# Altium project H204.PrjPCB
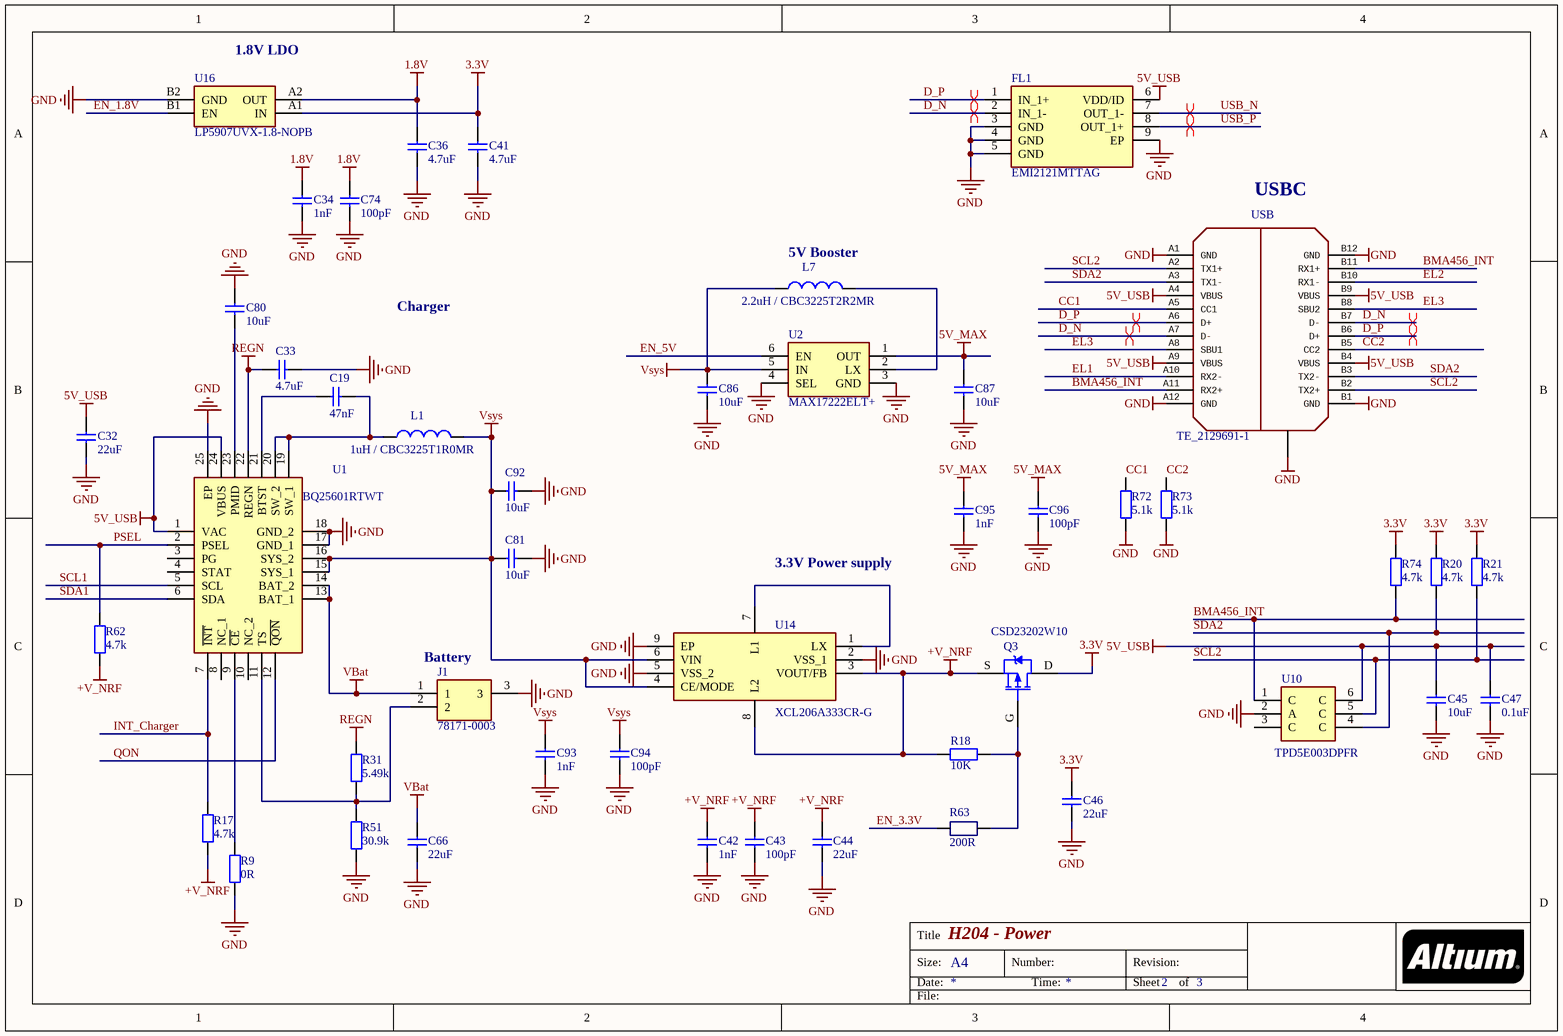
[diagram p0: H204_R_Power.SchDoc]
1 sheet, 46 parts. Net scope: global (net labels, ports and power ports of the same name join across sheets).
Board file: H204_.PcbDoc

## Sheet H204_R_Power.SchDoc: H204 - Power
size A4; SheetNumber: 2; SheetTotal: 3; PageSetup: Record=PageOptions|CenterHorizontal=True|CenterVertical=True|PrintScale=0.63|XCorrection=1.00|YCorrection=1.00|PrintKind=0|BorderSize=5000000|LeftOffset=0|BottomOffset=0|Orientation=2|PaperLength=2794|PaperWidth=4318|Scale=100|PaperSource=7|PrintQuality=600|MediaType=1|DitherType=10|PaperKind=Legal (8 ½ x 14 in)|PrintScaleMode=1

### Parts
C19  47nF  [CAPC0603X33N]
C32  22uF  [CAPC1005X55N]
C33  4.7uF  [CAPC1005X55N]
C34  1nF  [CAPC0603X33N]
C36  4.7uF  [CAPC1005X55N]
C41  4.7uF  [CAPC1005X55N]
C42  1nF  [CAPC0603X33N]
C43  100pF  [CAPC0603X33N]
C44  22uF  [CAPC1005X55N]
C45  10uF  [CAPC1005X55N]
C46  22uF  [CAPC1005X55N]
C47  0.1uF  [CAPC0603X33N]
C66  22uF  [CAPC1005X55N]
C74  100pF  [CAPC0603X33N]
C80  10uF  [CAPC1005X55N]
C81  10uF  [CAPC1005X55N]
C86  10uF  [CAPC1005X55N]
C87  10uF  [CAPC1005X55N]
C92  10uF  [CAPC1005X55N]
C93  1nF  [CAPC0603X33N]
C94  100pF  [CAPC0603X33N]
C95  1nF  [CAPC0603X33N]
C96  100pF  [CAPC0603X33N]
FL1  EMI2121MTTAG  [EMI2121MTTAG]
J1  78171-0003  [78171-0003]
L1  1uH / CBC3225T1R0MR  [INDM3225X210N]
L7  2.2uH / CBC3225T2R2MR  [INDM3225X210N]
Q3  CSD23202W10  [4-UFBGA]
R9  0R  [RESC0603X26N]
R17  4.7k  [RESC0603X26N]
R18  10k  [RESC0603X26N]
R20  4.7k  [RESC0603X26N]
R21  4.7k  [RESC0603X26N]
R31  5.49k  [RESC0603X26N]
R51  30.9k  [RESC0603X26N]
R62  4.7k  [RESC0603X26N]
R63  200R  [RESC0603X26N]
R72  5.1k  [RESC0603X26N]
R73  5.1k  [RESC0603X26N]
R74  4.7k  [RESC0603X26N]
U1  BQ25601RTWT  [QFN50P400X400X80-25N-D]
U2  MAX17222ELT+  [MAX17220ALT]
U10  TPD5E003DPFR  [SON35P100X100X40-6N]
U14  XCL206A333CR-G  [XCL206A333CRG]
U16  LP5907UVX-1.8-NOPB  [BGA4C35P2X2_64X64X44]
USB  TE_2129691-1  [TE_2129691-1]

### Nets
1.8V: C34.1 C36.1 C74.1 U16.A2(OUT)
3.3V: C41.1 C46.1 Q3.D R20.1 R21.1 R74.1 U16.A1(IN)
5V_MAX: C87.1 C95.1 C96.1 U2.1(OUT)
5V_USB: C32.1 C45.1 C47.1 FL1.6(VDD/ID) U1.1(VAC) U1.24(VBUS) U10.6(C) USB.A4(VBUS) USB.A9(VBUS) USB.B4(VBUS) USB.B9(VBUS)
+V_NRF: C42.2 C43.1 C44.1 Q3.S R17.2 R18.2 R62.2 U14.3(VOUT/FB) U14.8(L2)
GND: C32.2 C33.2 C34.2 C36.2 C41.2 C42.1 C43.2 C44.2 C45.2 C46.2 C47.2 C66.2 C74.2 C80.2 C81.2 C86.2 C87.2 C92.2 C93.2 C94.2 C95.2 C96.2 FL1.3(GND) FL1.4(GND) FL1.5(GND) FL1.9(EP) J1.3 R9.1 R51.2 R72.2 R73.2 U1.17(GND_1) U1.18(GND_2) U1.25(EP) U2.3(GND) U2.4(SEL) U10.2(A) U14.2(VSS_1) U14.5(VSS_2) U14.9(EP) U16.B2(GND) USB.A1(GND) USB.A12(GND) USB.B1(GND) USB.B12(GND) USB.SH
REGN: C33.1 R31.1 U1.22(REGN)
VBat: C66.1 J1.1 U1.13(BAT_1) U1.14(BAT_2)
Vsys: C81.1 C86.1 C92.1 C93.1 C94.1 L1.2 L7.1 U1.15(SYS_1) U1.16(SYS_2) U2.5(IN) U14.4(CE/MODE) U14.6(VIN)
BMA456_INT: R74.2 U10.1(C) USB.A11(RX2+) USB.B11(RX1+)
CC1: R72.1 USB.A5(CC1)
CC2: R73.1 USB.B5(CC2)
D_N: FL1.2(IN_1-) USB.A7(D-) USB.B7(D-)
D_P: FL1.1(IN_1+) USB.A6(D+) USB.B6(D+)
EL1: USB.A10(RX2-)
EL2: USB.B10(RX1-)
EL3: USB.A8(SBU1) USB.B8(SBU2)
EN_1.8V: U16.B1(EN)
EN_3.3V: R63.1
EN_5V: U2.6(EN)
INT_Charger: R17.1 U1.7(~{INT})
PSEL: R62.1 U1.2(PSEL)
QON: U1.12(~{QON})
SCL1: U1.5(SCL)
SCL2: R21.2 U10.5(C) USB.A2(TX1+) USB.B2(TX2+)
SDA1: U1.6(SDA)
SDA2: R20.2 U10.4(C) USB.A3(TX1-) USB.B3(TX2-)
USB_N: FL1.7(OUT_1-)
USB_P: FL1.8(OUT_1+)
NetC19_1: C19.1 L1.1 U1.19(SW_1) U1.20(SW_2)
NetC19_2: C19.2 U1.21(BTST)
NetC80_1: C80.1 U1.23(PMID)
NetJ1_2: J1.2 R31.2 R51.1 U1.11(TS)
NetL7_2: L7.2 U2.2(LX)
NetQ3_G: Q3.G R18.1 R63.2
NetR9_2: R9.2 U1.9(~{CE})
NetU14_1: U14.1(LX) U14.7(L1)

Not connected (* = marked no-connect by the designer): U1 3(PG) 4(STAT) 8(NC_1) 10(NC_2); U10 3(C)

### Layout directives
differential pair: D_N, D_P, USB_N, USB_P

### Notes on the sheet
- (near U16) 1.8V LDO
- USBC
- Charger
- (near L7) 5V Booster
- 3.3V Power supply
- (near J1) Battery
- Title
- Size:
- Date:
- A4
- Number:
- Time:
- Revision:
- Sheet
- of
- File:

### Library data of the parts
C19 = C0402-100n: CAP CER 0.047UF 25V X5R 0201; Manufacturer: TDK; Manufacturer Part Number: C0603X5R1E473K030BB; Dielectric Material: Ceramic; Tolerance: 10%; Supplier 1: Digi-Key; Supplier Part Number 1: 445-13679-1-ND; RoHS: Yes; Category: Ceramic Capacitors; Stock 1: 131887; Pricing 1: 1=0,10000, 10=0,07600, 50=0,04140, 100=0,03380, 500=0,02416, 1000=0,01898, 2500=0,01725, 5000=0,01587 (USD); Mount: Surface Mount; Case/Package: 0201; Case Code (Metric): 0603; Case Code (Imperial): 0201; Weight: 6E-06oz; Min Operating Temperature: -55°C; Max Operating Temperature: 85°C; Package Quantity: 15000; Packaging: Tape and Reel; Capacitance: 47nF; Voltage Rating: 25V; Dielectric: X5R; Termination: SMD/SMT; Voltage Rating (DC): 25V; Series: C; Length: 0.024inch; Width: 0.3mm; Height: 0.3mm; Thickness: 0.013inch; Lead Free: Lead Free; RoHS Compliant: Yes; ComponentLink1URL: https://datasheet.ciiva.com/14887/tdkmlcccaprange-14887813.pdf?src-supplier=Digi-Key; ComponentLink1Description: https://datasheet.ciiva.com/14887/tdkmlcccaprange-14887813.pdf?src-supplier=Digi-Key; ComponentLink2URL: https://datasheet.ciiva.com/14887/tdkmlcccaprange-14887815.pdf?src-supplier=Digi-Key; ComponentLink2Description: https://datasheet.ciiva.com/14887/tdkmlcccaprange-14887815.pdf?src-supplier=Digi-Key; ComponentLink3URL: https://datasheet.ciiva.com/14887/tdkmlcccaprange-14887817.pdf?src-supplier=Digi-Key; ComponentLink3Description: https://datasheet.ciiva.com/14887/tdkmlcccaprange-14887817.pdf?src-supplier=Digi-Key
C32 C44 C46 C66 = C0603-4µ7: CAP CER 22UF 6.3V X5R 0402; Manufacturer: Samsung; Manufacturer Part Number: CL05A226MQ5QUNC; Tolerance: 20%; Value: 22uF; Supplier 1: Digi-Key; Supplier Part Number 1: 1276-6834-1-ND; RoHS: Yes; Category: Ceramic Capacitors; Stock 1: 587155; Pricing 1: 1=0,60000, 10=0,42200, 50=0,31940, 100=0,27820, 500=0,20608, 1000=0,17517, 2500=0,16486, 5000=0,15456 (USD); Mount: Surface Mount; Case/Package: 0402; Case Code (Metric): 1005; Case Code (Imperial): 0402; Min Operating Temperature: -55°C; Max Operating Temperature: 85°C; Packaging: Tape and Reel; Capacitance: 22uF; Voltage Rating: 6.3V; Length: 0.039inch; Width: 0.02inch; Thickness: 0.022inch; RoHS Compliant: Yes; ComponentLink1URL: http://www.samsungsem.com/kr/support/product-search/mlcc/__icsFiles/afieldfile/2018/08/20/Data%20sheet_CL05A226MQ5QUNC.pdf?src-supplier=Digi-Key; ComponentLink1Description: http://www.samsungsem.com/kr/support/product-search/mlcc/__icsFiles/afieldfile/2018/08/20/Data%20sheet_CL05A226MQ5QUNC.pdf?src-supplier=Digi-Key
C33 C36 C41 = C0603-4µ7: Cap Ceramic 4.7uF 16V X5R 20% SMD 0402 85C T/R; Manufacturer: Samsung; Manufacturer Part Number: CL05A475MO5NUNC; Value: 4.7uF; Supplier 1: Digi-Key; Supplier Part Number 1: 1276-6836-1-ND; RoHS: Yes; Category: Ceramic Capacitors; Stock 1: 298882; Pricing 1: 1=0,51000, 10=0,35100, 50=0,24600, 100=0,21090, 500=0,15814, 1000=0,13355, 2500=0,12652, 5000=0,11949 (USD); Mount: Surface Mount; Case/Package: 0402; Case Code (Metric): 1005; Case Code (Imperial): 0402; Min Operating Temperature: -55°C; Max Operating Temperature: 85°C; Packaging: Tape and Reel; Capacitance: 4.7uF; Voltage Rating: 16V; Tolerance: 20%; Length: 0.039inch; Width: 0.02inch; Thickness: 0.022inch; RoHS Compliant: Yes; ComponentLink1URL: http://www.farnell.com/datasheets/2710653.pdf?src-supplier=Farnell; ComponentLink1Description: http://www.farnell.com/datasheets/2710653.pdf?src-supplier=Farnell; ComponentLink2URL: http://www.farnell.com/datasheets/2710653.pdf?src-supplier=Newark; ComponentLink2Description: http://www.farnell.com/datasheets/2710653.pdf?src-supplier=Newark; ComponentLink3URL: http://www.samsungsem.com/kr/support/product-search/mlcc/CL05A475MO5NUNC.jsp?src-supplier=Digi-Key; ComponentLink3Description: http://www.samsungsem.com/kr/support/product-search/mlcc/CL05A475MO5NUNC.jsp?src-supplier=Digi-Key
C34 C42 C93 C95 = C0402-100n: Cap Ceramic 0.001uF 25V X7R 10% SMD 0201 125C Paper T/R; Manufacturer: Samsung; Manufacturer Part Number: CL03B102KA3NNNC; Value: 1nF; Supplier 1: Digi-Key; Supplier Part Number 1: 1276-1341-1-ND; RoHS: Yes; Category: Ceramic Capacitors; Stock 1: 1034478; Pricing 1: 1=0,13000, 10=0,08900, 50=0,05080, 100=0,04200, 500=0,02946, 1000=0,02439, 2500=0,02270, 5000=0,02077 (USD); Mount: Surface Mount; Case/Package: 0201; Contact Plating: Tin; Case Code (Metric): 0603; Case Code (Imperial): 0201; Min Operating Temperature: -55°C; Max Operating Temperature: 125°C; Package Quantity: 1; Packaging: Tape and Reel; Capacitance: 1nF; Tolerance: 10%; Dielectric: X7R; Voltage Rating: 25V; Series: CL; Construction: Flat; Length: 0.6mm; Width: 0.012inch; Height: 0.3mm; Thickness: 0.013inch; Depth: 0.3mm; Radiation Hardening: No; RoHS Compliant: Yes; ComponentLink1URL: https://datasheet.ciiva.com/25788/cl03b102ka3nnnc-25788656.pdf?src-supplier=Digi-Key; ComponentLink1Description: https://datasheet.ciiva.com/25788/cl03b102ka3nnnc-25788656.pdf?src-supplier=Digi-Key; ComponentLink2URL: https://datasheet.ciiva.com/26838/getdatasheetpartid-355161-26838110.pdf?src-supplier=Verical; ComponentLink2Description: https://datasheet.ciiva.com/26838/getdatasheetpartid-355161-26838110.pdf?src-supplier=Verical
C43 C74 C94 C96 = C0402-100n: CAP CER 100PF 50V C0G 0201; Manufacturer: TDK; Manufacturer Part Number: C0603C0G1H101J030BA; Dielectric Material: Ceramic; Tolerance: 5%; Insulation Resistance: 10GR; Value: 100pF; Supplier 1: Digi-Key; Supplier Part Number 1: 445-1786-1-ND; RoHS: Yes; Category: Ceramic Capacitors; Stock 1: 312493; Pricing 1: 1=0,10000, 10=0,06800, 50=0,03720, 100=0,03040, 500=0,02174, 1000=0,01708, 2500=0,01552, 5000=0,01428 (USD); Mount: Surface Mount; Case/Package: 0201; Number of Pins: 2; Case Code (Metric): 0603; Case Code (Imperial): 0201; Weight: 6E-06oz; Min Operating Temperature: -55°C; Max Operating Temperature: 125°C; Package Quantity: 1; Capacitance: 100pF; Voltage Rating: 50V; Packaging: Tape and Reel; Voltage Rating (DC): 50V; Dielectric: C0G; Termination: SMD/SMT; Construction: Flat; Voltage: 50V; Series: C; Length: 0.6mm; Width: 0.012inch; Height: 0.3mm; Depth: 0.3mm; Thickness: 0.013inch; Lead Free: Lead Free; REACH SVHC: Unknown; RoHS Compliant: Yes; ComponentLink1URL: https://datasheet.ciiva.com/24217/c0603c0g1h101j030ba-264106-24217425.pdf?src-supplier=Mouser; ComponentLink1Description: https://datasheet.ciiva.com/24217/c0603c0g1h101j030ba-264106-24217425.pdf?src-supplier=Mouser; ComponentLink2URL: https://datasheet.ciiva.com/16205/mlcc-commercial-general-en-16205590.pdf?src-supplier=Future+Electronics; ComponentLink2Description: https://datasheet.ciiva.com/16205/mlcc-commercial-general-en-16205590.pdf?src-supplier=Future+Electronics; ComponentLink3URL: https://datasheet.ciiva.com/6250/tdkmlcccaprange-6250351.pdf?src-supplier=Digi-Key; ComponentLink3Description: https://datasheet.ciiva.com/6250/tdkmlcccaprange-6250351.pdf?src-supplier=Digi-Key
C45 C80 C81 C86 C87 C92 = C0603-4µ7: CAP CER 10UF 10V X5R 0402; Manufacturer: Samsung; Manufacturer Part Number: CL05A106MP8NUB8; Tolerance: 20%; Value: 10uF; Supplier 1: Digi-Key; Supplier Part Number 1: 1276-6830-2-ND; RoHS: Yes; Category: Ceramic Capacitors; Stock 1: 5635891; Pricing 1: 8000=0,08247 (USD); Mount: Surface Mount; Case/Package: 0402; Case Code (Metric): 1005; Case Code (Imperial): 0402; Min Operating Temperature: -55°C; Max Operating Temperature: 85°C; Packaging: Tape and Reel; Capacitance: 10uF; Voltage Rating: 10V; Length: 0.039inch; Width: 0.02inch; Thickness: 0.035inch; RoHS Compliant: Yes; ComponentLink1URL: http://www.samsungsem.com/kr/support/product-search/mlcc/CL05A106MP8NUB8.jsp?src-supplier=Digi-Key; ComponentLink1Description: http://www.samsungsem.com/kr/support/product-search/mlcc/CL05A106MP8NUB8.jsp?src-supplier=Digi-Key
C47 = C0201-100n: CAP CER 0.1UF 16V X5R 0201; Manufacturer: Samsung; Manufacturer Part Number: CL03A104KO3NNNC; Capacitance: 100nF; Tolerance: 10%; Value: 0.1uF; Supplier 1: Digi-Key; Supplier Part Number 1: 1276-1319-1-ND; RoHS: Yes; Category: Ceramic Capacitors; Stock 1: 1005663; Pricing 1: 1=0,12000, 10=0,08500, 50=0,04640, 100=0,03790, 500=0,02704, 1000=0,02125, 2500=0,01932, 5000=0,01777 (USD); Mount: Surface Mount; Case/Package: 0201; Case Code (Metric): 0603; Case Code (Imperial): 0201; Contact Plating: Tin; Min Operating Temperature: -55°C; Max Operating Temperature: 85°C; Package Quantity: 1; Packaging: Tape and Reel; Voltage Rating: 16V; Dielectric: X5R; Voltage Rating (DC): 16V; Series: CL; Construction: Flat; Length: 0.6mm; Width: 0.012inch; Height: 0.3mm; Thickness: 0.013inch; Depth: 0.3mm; Radiation Hardening: No; RoHS Compliant: Yes; ComponentLink1URL: https://datasheet.ciiva.com/25794/cl03a104ko3nnnc-25794320.pdf?src-supplier=Digi-Key; ComponentLink1Description: https://datasheet.ciiva.com/25794/cl03a104ko3nnnc-25794320.pdf?src-supplier=Digi-Key; ComponentLink2URL: https://datasheet.ciiva.com/26838/getdatasheetpartid-359638-26838082.pdf?src-supplier=Verical; ComponentLink2Description: https://datasheet.ciiva.com/26838/getdatasheetpartid-359638-26838082.pdf?src-supplier=Verical
FL1 = EMI2121MTTAG: ON SEMICONDUCTOR - EMI2121MTTAG - Common Mode Filter, USB 2.0, WDFN-8; Number of Lines: 3; DC Resistance (DCR): 8R; Max Current Rating: 100mA; Capacitance: 1.3pF; Voltage Rating: 9V; Direction: Bidirectional; ESD Protection: Yes; Assembly: Rechargeable; Supplier 1: Digi-Key; Supplier Part Number 1: EMI2121MTTAGOSCT-ND; Manufacturer: ON Semiconductor; Manufacturer Part Number: EMI2121MTTAG; RoHS: Yes; Category: Common Mode Chokes; Stock 1: 14076; Pricing 1: 1=1,01000, 10=0,89900, 25=0,85320, 100=0,70090, 250=0,65520, 500=0,57902, 1000=0,50312 (USD); Number of Pins: 8; Min Operating Temperature: -40°C; Max Operating Temperature: 85°C; Packaging: Tape and Reel; Package Quantity: 1; Current: 100mA; Termination: Flat; Current Rating: 100mA; Max DC Current: 100mA; Series: -; DC Resistance-Max: 8R; Length: 2.2mm; Width: 0.079inch; Height: 0.031inch; Depth: 2mm; Lead Free: Lead Free; Halogen Free: Halogen Free; RoHS Compliant: Yes; REACH SVHC: No SVHC; ComponentLink1URL: https://datasheet.ciiva.com/6214/emi2121mt-d-6214625.pdf?src-supplier=Digi-Key; ComponentLink1Description: https://datasheet.ciiva.com/6214/emi2121mt-d-6214625.pdf?src-supplier=Digi-Key; ComponentLink2URL: https://datasheet.ciiva.com/12394/emi2121mt-d-72518-12394918.pdf?src-supplier=Mouser; ComponentLink2Description: https://datasheet.ciiva.com/12394/emi2121mt-d-72518-12394918.pdf?src-supplier=Mouser; ComponentLink3URL: https://datasheet.ciiva.com/3067/emi2121mt-d-3067884.pdf?src-supplier=Avnet; ComponentLink3Description: https://datasheet.ciiva.com/3067/emi2121mt-d-3067884.pdf?src-supplier=Avnet; ComponentLink4URL: https://datasheet.ciiva.com/6214/emi2121mt-d-6214619.pdf?src-supplier=Digi-Key; ComponentLink4Description: https://datasheet.ciiva.com/6214/emi2121mt-d-6214619.pdf?src-supplier=Digi-Key; ComponentLink5URL: https://datasheet.ciiva.com/15162/getdatasheetpartid-686641-15162525.pdf?src-supplier=Verical; ComponentLink5Description: https://datasheet.ciiva.com/15162/getdatasheetpartid-686641-15162525.pdf?src-supplier=Verical; ComponentLink6URL: https://datasheet.ciiva.com/16437/emi2121mt-d-16437709.pdf?src-supplier=Future+Electronics; ComponentLink6Description: https://datasheet.ciiva.com/16437/emi2121mt-d-16437709.pdf?src-supplier=Future+Electronics; ComponentLink7URL: https://datasheet.ciiva.com/6214/emi2121mt-d-6214622.pdf?src-supplier=Digi-Key; ComponentLink7Description: https://datasheet.ciiva.com/6214/emi2121mt-d-6214622.pdf?src-supplier=Digi-Key
J1 = 78171-0003: Conn Wire to Board HDR 3 POS 1.2mm Solder ST SMD Embossed T/R; Manufacturer_Name: Molex; Number of Contacts: 3; Contact Resistance: 20mR; Max Voltage Rating (DC): 5.05kV; Max Voltage Rating (AC): 50V; Current Rating: 1.5A; Gender: Male; Glow Wire Compliant: Non-compliant; Datasheet Link: http://docs-emea.rs-online.com/webdocs/150e/0900766b8150e2fd.pdf; Manufacturer_Part_Number: 78171-0003; Mouser Part Number: 538-78171-0003; Mouser Price/Stock: https://www.mouser.co.uk/ProductDetail/Molex/78171-0003?qs=rg3U%2F5nEhHfwDfjly946YA%3D%3D; Supplier 1: Digi-Key; Supplier Part Number 1: WM5409CT-ND; Manufacturer: Molex; Manufacturer Part Number: 78171-0003; RoHS: Yes; Category: Headers and Wire Housings; Pricing 1: 1=0,40000, 10=0,32100, 100=0,23540, 1000=0,18724 (USD); Mount: Surface Mount; Contact Plating: Gold; Contact Material: Copper Alloy,Copper; Housing Color: Black; Housing Material: Polymer; Min Operating Temperature: -25°C; Max Operating Temperature: 85°C; Number of Rows: 1; Termination: Solder; Packaging: Tape and Reel; Number of Positions: 3; Orientation: Vertical; Series: Pico-Ezmate; Voltage Rating: 50V; Contact Gender: Male; Package Quantity: 4500; Voltage Rating (AC): 50V; Number of Circuits: 3; Length: 5.4mm; Pitch: 1.2mm; Depth: 4.5mm; Radiation Hardening: No; RoHS Compliant: Yes; REACH SVHC: Unknown; Halogen Free: Low Halogen; ComponentLink1URL: https://datasheet.ciiva.com/22680/1701259-22680435.pdf?src-supplier=Element14; ComponentLink1Description: https://datasheet.ciiva.com/22680/1701259-22680435.pdf?src-supplier=Element14; ComponentLink2URL: https://datasheet.ciiva.com/5152/0781710003-pcb-headers-152538-5152745.pdf?src-supplier=Mouser; ComponentLink2Description: https://datasheet.ciiva.com/5152/0781710003-pcb-headers-152538-5152745.pdf?src-supplier=Mouser; ComponentLink3URL: https://datasheet.ciiva.com/11746/0900766b80dca492-11746471.pdf?src-supplier=RSComponents; ComponentLink3Description: https://datasheet.ciiva.com/11746/0900766b80dca492-11746471.pdf?src-supplier=RSComponents; ComponentLink4URL: https://datasheet.ciiva.com/16108/16720781710003-pcb-headers-16108033.pdf?src-supplier=Onlinecomponents.com; ComponentLink4Description: https://datasheet.ciiva.com/16108/16720781710003-pcb-headers-16108033.pdf?src-supplier=Onlinecomponents.com; ComponentLink5URL: https://datasheet.ciiva.com/30073/92470781710003-pcb-headers-30073464.pdf?src-supplier=Onlinecomponents.com; ComponentLink5Description: https://datasheet.ciiva.com/30073/92470781710003-pcb-headers-30073464.pdf?src-supplier=Onlinecomponents.com; ComponentLink6URL: https://datasheet.ciiva.com/10088/0781710003-pcb-headers-10088254.pdf?src-supplier=Avnet; ComponentLink6Description: https://datasheet.ciiva.com/10088/0781710003-pcb-headers-10088254.pdf?src-supplier=Avnet; ComponentLink7URL: https://datasheet.ciiva.com/16737/0781710003-pcb-headers-16737007.pdf?src-supplier=Avnet+Europe; ComponentLink7Description: https://datasheet.ciiva.com/16737/0781710003-pcb-headers-16737007.pdf?src-supplier=Avnet+Europe
L1 = Inductor: Inductor Power Chip Wirewound 1uH 20% 100KHz Ferrite 1.44A 71.5mOhm DCR 1210 T/R; Manufacturer: Taiyo Yuden; Manufacturer Part Number: CBC3225T2R2MR; Inductance: 2.2uH; DC Resistance (DCR): 104mR; Max DC Current: 1.13A; Self Resonant Frequency: 190MHz; Shielding: Unshielded; Saturation Current: 2A; Resistance: 0.055R; Supplier 1: Digi-Key; Supplier Part Number 1: 587-1623-1-ND; RoHS: Yes; Category: Fixed Inductors; Stock 1: 14109; Pricing 1: 1=0,30000, 10=0,26800, 25=0,23480, 50=0,20120, 100=0,18450, 250=0,16776, 500=0,15768 (USD); Mount: Surface Mount; Case/Package: 1210; Number of Pins: 2; Case Code (Metric): 3225; Case Code (Imperial): 1210; Core Material: Ferrite; Min Operating Temperature: -40°C; Max Operating Temperature: 105°C; Tolerance: 20%; Packaging: Tape and Reel; Test Frequency: 100kHz; Termination: SMD/SMT; Current Rating: 1.13A; Package Quantity: 1000; Resistor Type: Wirewound; Series: CB; Inductance Tolerance: 20%; Length: 0.126inch; Width: 0.098inch; Height: 2.5mm; Height - Seated (Max): 0.106inch; RoHS Compliant: Yes; Lead Free: Lead Free; REACH SVHC: Unknown; Halogen Free: Halogen Free; ComponentLink1URL: https://datasheet.ciiva.com/6701/cbc3225t2r2mr-ss-6701089.pdf?src-supplier=Digi-Key; ComponentLink1Description: https://datasheet.ciiva.com/6701/cbc3225t2r2mr-ss-6701089.pdf?src-supplier=Digi-Key; ComponentLink2URL: https://datasheet.ciiva.com/15981/1309cbc3225t2r2mr-15981708.pdf?src-supplier=Onlinecomponents.com; ComponentLink2Description: https://datasheet.ciiva.com/15981/1309cbc3225t2r2mr-15981708.pdf?src-supplier=Onlinecomponents.com; ComponentLink3URL: https://datasheet.ciiva.com/8505/cbc3225t2r2mr-ss-8505613.pdf?src-supplier=Avnet; ComponentLink3Description: https://datasheet.ciiva.com/8505/cbc3225t2r2mr-ss-8505613.pdf?src-supplier=Avnet; Supplier 2: Digi-Key; Supplier Part Number 2: 587-1622-1-ND; Stock 2: 19038; Pricing 2: 1=0,30000, 10=0,26800, 25=0,23480, 50=0,20120, 100=0,18450, 250=0,16776, 500=0,15768 (USD); Inductor Type: POWER; ComponentLink4URL: https://datasheet.ciiva.com/8505/cbc3225t1r0mr-ss-8505606.pdf?src-supplier=Avnet; ComponentLink4Description: https://datasheet.ciiva.com/8505/cbc3225t1r0mr-ss-8505606.pdf?src-supplier=Avnet; ComponentLink5URL: https://datasheet.ciiva.com/1040/cbc3225t1r0mr-ss-1040872.pdf?src-supplier=Digi-Key; ComponentLink5Description: https://datasheet.ciiva.com/1040/cbc3225t1r0mr-ss-1040872.pdf?src-supplier=Digi-Key
L7 = Inductor: Ind Power Chip Wirewound 2.2uH 20% 100KHz Ferrite 1.13A 1210 T/R; Manufacturer: Taiyo Yuden; DC Resistance (DCR): 104mR; Self Resonant Frequency: 190MHz; Shielding: Unshielded; Saturation Current: 2A; Supplier 1: Digi-Key; Supplier Part Number 1: 587-1623-1-ND; Manufacturer Part Number: CBC3225T2R2MR; RoHS: Yes; Category: Fixed Inductors; Stock 1: 14109; Pricing 1: 1=0,30000, 10=0,26800, 25=0,23480, 50=0,20120, 100=0,18450, 250=0,16776, 500=0,15768 (USD); Mount: Surface Mount; Case/Package: 1210; Number of Pins: 2; Case Code (Metric): 3225; Case Code (Imperial): 1210; Core Material: Ferrite; Min Operating Temperature: -40°C; Max Operating Temperature: 105°C; Tolerance: 20%; Inductance: 2.2uH; Max DC Current: 1.13A; Packaging: Tape and Reel; Test Frequency: 100kHz; Termination: SMD/SMT; Current Rating: 1.13A; Package Quantity: 1000; Resistor Type: Wirewound; Series: CB; Inductance Tolerance: 20%; Length: 0.126inch; Width: 0.098inch; Height: 2.5mm; Height - Seated (Max): 0.106inch; RoHS Compliant: Yes; Lead Free: Lead Free; REACH SVHC: Unknown; Halogen Free: Halogen Free; ComponentLink1URL: https://datasheet.ciiva.com/6701/cbc3225t2r2mr-ss-6701089.pdf?src-supplier=Digi-Key; ComponentLink1Description: https://datasheet.ciiva.com/6701/cbc3225t2r2mr-ss-6701089.pdf?src-supplier=Digi-Key; ComponentLink2URL: https://datasheet.ciiva.com/15981/1309cbc3225t2r2mr-15981708.pdf?src-supplier=Onlinecomponents.com; ComponentLink2Description: https://datasheet.ciiva.com/15981/1309cbc3225t2r2mr-15981708.pdf?src-supplier=Onlinecomponents.com; ComponentLink3URL: https://datasheet.ciiva.com/8505/cbc3225t2r2mr-ss-8505613.pdf?src-supplier=Avnet; ComponentLink3Description: https://datasheet.ciiva.com/8505/cbc3225t2r2mr-ss-8505613.pdf?src-supplier=Avnet
Q3 = Transistor P-channel: -12V, P ch NexFET MOSFET™, single WLP 1.0x1.0, 53mOhm 4-DSBGA; Manufacturer: Texas Instruments; Drain to Source Voltage (Vdss): 12V; Continuous Drain Current (ID): 2.2A; Rds On Max: 53mR; Input Capacitance: 512pF; Max Power Dissipation: 1W; Gate to Source Voltage (Vgs): 6V; Number of Channels: 1; Drain to Source Resistance: 44mR; Fall Time: 21ns; Rise Time: 4ns; Turn-Off Delay Time: 58ns; Turn-On Delay Time: 9ns; Supplier 1: Digi-Key; Supplier Part Number 1: 296-40000-1-ND; Manufacturer Part Number: CSD23202W10; RoHS: Yes; Category: Integrated Circuits (ICs); Stock 1: 87297; Pricing 1: 1=0,43000, 10=0,37100, 100=0,27720, 500=0,21780, 1000=0,16830 (USD); Mount: Surface Mount; Number of Pins: 4; Min Operating Temperature: -55°C; Max Operating Temperature: 150°C; Packaging: Tape and Reel; Drain to Source Breakdown Voltage: -12V; Package Quantity: 3000; Element Configuration: Single; Number of Elements: 1; Power Dissipation: 1W; Lead Free: Lead Free; RoHS Compliant: Yes; ComponentLink1URL: http://components.arrow.com/part/dataview/69249902S1040162N7713?src-supplier=Arrow+Electronics; ComponentLink1Description: http://components.arrow.com/part/dataview/69249902S1040162N7713?src-supplier=Arrow+Electronics; ComponentLink2URL: http://www.ti.com/lit/gpn/csd23202w10?src-supplier=Mouser; ComponentLink2Description: http://www.ti.com/lit/gpn/csd23202w10?src-supplier=Mouser; ComponentLink3URL: http://www.ti.com/lit/ds/symlink/csd23202w10.pdf?src-supplier=Digi-Key; ComponentLink3Description: http://www.ti.com/lit/ds/symlink/csd23202w10.pdf?src-supplier=Digi-Key; ComponentLink4URL: http://www.ti.com/general/docs/lit/getliterature.tsp?genericPartNumber=CSD23202W10&&fileType=pdf&src-supplier=Avnet; ComponentLink4Description: http://www.ti.com/general/docs/lit/getliterature.tsp?genericPartNumber=CSD23202W10&&fileType=pdf&src-supplier=Avnet
R9 = Res2: Fixed Resistor, Metal Glaze/thick Film, 0.05W, 0ohm, Surface Mount, 0201; Manufacturer: Yageo; Manufacturer Part Number: AF0201JR-070RL; Resistance: 0mR; Max Power Dissipation: 50mW; Value: 0R; Supplier 1: Digi-Key; Supplier Part Number 1: 13-AF0201JR-070RLCT-ND; RoHS: Yes; Category: Chip SMD Resistors; Stock 1: 9; Pricing 1: 1=0,11000, 10=0,09500, 25=0,06560, 50=0,05100, 100=0,03640, 250=0,02840, 500=0,02256, 1000=0,01602, 5000=0,01238 (USD); Case/Package: 0201; Case Code (Imperial): 0201; Case Code (Metric): 0603; Weight: 6E-06oz; Min Operating Temperature: -55°C; Max Operating Temperature: 125°C; Packaging: Tape and Reel; Resistor Type: Thick Film; Number of Terminations: 2; Package Quantity: 10000; Termination: SMD/SMT; Features: Moisture Resistant,Anti-Sulfur; Length: 0.024inch; Width: 0.012inch; Height: 0.01inch; RoHS Compliant: Yes; ComponentLink1URL: http://www.mouser.com/ds/2/447/PYu-AF_51_RoHS_L_5-1085711.pdf?src-supplier=Mouser; ComponentLink1Description: http://www.mouser.com/ds/2/447/PYu-AF_51_RoHS_L_5-1085711.pdf?src-supplier=Mouser; ComponentLink2URL: http://www.yageo.com/documents/recent/PYu-AF_51_RoHS_L_5.pdf?src-supplier=Digi-Key; ComponentLink2Description: http://www.yageo.com/documents/recent/PYu-AF_51_RoHS_L_5.pdf?src-supplier=Digi-Key
R17 R20 R21 R62 R74 = Res2: GENERAL 0201 11% REEL (7INCH); Manufacturer: Yageo; Manufacturer Part Number: RC0201FR-074K7L; Resistance: 4.7kR; Tolerance: 1%; Temperature Coefficient: 200ppm/°C; Power Rating: 50mW; Voltage Rating: 25V; Value: 4.7k; Supplier 1: Digi-Key; Supplier Part Number 1: 311-4.70KMCT-ND; RoHS: Yes; Category: Chip SMD Resistors; Stock 1: 638424; Pricing 1: 1=0,10000, 10=0,04200, 100=0,01700, 1000=0,00765, 2500=0,00664, 5000=0,00548 (USD); Case/Package: 0201; Contact Plating: Tin,Matte; Case Code (Metric): 0603; Case Code (Imperial): 0201; Weight: 6E-06oz; Size Code: 0201; Min Operating Temperature: -55°C; Max Operating Temperature: 125°C; Resistor Type: Thick Film; Packaging: Tape and Reel; Package Quantity: 1; Number of Terminations: 2; Termination: SMD/SMT; Max Power Dissipation: 50mW; Features: Moisture Resistant; Series: RC; Resistance Tolerance: 1%; Construction: Rectangular; Length: 0.6mm; Width: 0.012inch; Height: 0.01inch; Depth: 0.3mm; Radiation Hardening: No; REACH SVHC: Unknown; Military Standard: Not; Lead Free: Lead Free; RoHS Compliant: Yes; ComponentLink1URL: https://datasheet.ciiva.com/2493/pyu-r-int-thick-7-2493811.pdf?src-supplier=Digi-Key; ComponentLink1Description: https://datasheet.ciiva.com/2493/pyu-r-int-thick-7-2493811.pdf?src-supplier=Digi-Key; ComponentLink2URL: https://datasheet.ciiva.com/2493/pyu-r-int-thick-7-2493812.pdf?src-supplier=Digi-Key; ComponentLink2Description: https://datasheet.ciiva.com/2493/pyu-r-int-thick-7-2493812.pdf?src-supplier=Digi-Key; ComponentLink3URL: https://datasheet.ciiva.com/2493/pyu-r-int-thick-7-2493813.pdf?src-supplier=Digi-Key; ComponentLink3Description: https://datasheet.ciiva.com/2493/pyu-r-int-thick-7-2493813.pdf?src-supplier=Digi-Key; ComponentLink4URL: https://datasheet.ciiva.com/7672/1563626-7672233.pdf?src-supplier=Element14; ComponentLink4Description: https://datasheet.ciiva.com/7672/1563626-7672233.pdf?src-supplier=Element14; ComponentLink5URL: https://datasheet.ciiva.com/28410/pyu-rc0201-51-rohs-l-8-28410061.pdf?src-supplier=Avnet+Europe; ComponentLink5Description: https://datasheet.ciiva.com/28410/pyu-rc0201-51-rohs-l-8-28410061.pdf?src-supplier=Avnet+Europe; ComponentLink6URL: https://datasheet.ciiva.com/8892/pyu-rc0201-51-rohs-l-8-8892942.pdf?src-supplier=Avnet; ComponentLink6Description: https://datasheet.ciiva.com/8892/pyu-rc0201-51-rohs-l-8-8892942.pdf?src-supplier=Avnet
R18 = Res2: GENERAL 0201 11% REEL (7INCH); Manufacturer: Yageo; Manufacturer Part Number: RC0201FR-0710KL; Resistance: 10kR; Tolerance: 1%; Temperature Coefficient: 200ppm/°C; Power Rating: 50mW; Voltage Rating: 25V; Value: 10K; Supplier 1: Digi-Key; Supplier Part Number 1: 311-10.0KMCT-ND; RoHS: Yes; Category: Chip SMD Resistors; Stock 1: 2380407; Pricing 1: 1=0,10000, 10=0,04200, 100=0,01700, 1000=0,00765, 2500=0,00664, 5000=0,00548 (USD); Case/Package: 0201; Number of Pins: 2; Contact Plating: Tin,Matte; Case Code (Imperial): 0201; Case Code (Metric): 0603; Weight: 6E-06oz; Min Operating Temperature: -55°C; Max Operating Temperature: 125°C; Resistor Type: Thick Film; Packaging: Tape and Reel; Package Quantity: 1; Termination: SMD/SMT; Number of Terminations: 2; Max Power Dissipation: 50mW; Voltage Rating (DC): 25V; Working Voltage: 25V; Features: Moisture Resistant; Series: RC; Technology: THICK FILM; Resistance Tolerance: 1%; Construction: Rectangular; Length: 0.6mm; Width: 0.3mm; Height: 0.01inch; Depth: 0.3mm; Radiation Hardening: No; REACH SVHC: No SVHC; Military Standard: Not; Lead Free: Lead Free; RoHS Compliant: Yes; ComponentLink1URL: https://datasheet.ciiva.com/2467/pyu-r-int-thick-7-2467109.pdf?src-supplier=Digi-Key; ComponentLink1Description: https://datasheet.ciiva.com/2467/pyu-r-int-thick-7-2467109.pdf?src-supplier=Digi-Key; ComponentLink2URL: https://datasheet.ciiva.com/2467/pyu-r-int-thick-7-2467110.pdf?src-supplier=Digi-Key; ComponentLink2Description: https://datasheet.ciiva.com/2467/pyu-r-int-thick-7-2467110.pdf?src-supplier=Digi-Key; ComponentLink3URL: https://datasheet.ciiva.com/2467/pyu-r-int-thick-7-2467111.pdf?src-supplier=Digi-Key; ComponentLink3Description: https://datasheet.ciiva.com/2467/pyu-r-int-thick-7-2467111.pdf?src-supplier=Digi-Key; ComponentLink4URL: https://datasheet.ciiva.com/7660/1421516-7660807.pdf?src-supplier=Element14; ComponentLink4Description: https://datasheet.ciiva.com/7660/1421516-7660807.pdf?src-supplier=Element14; ComponentLink5URL: https://datasheet.ciiva.com/8891/pyu-rc0201-51-rohs-l-8-8891384.pdf?src-supplier=Avnet; ComponentLink5Description: https://datasheet.ciiva.com/8891/pyu-rc0201-51-rohs-l-8-8891384.pdf?src-supplier=Avnet; ComponentLink6URL: https://datasheet.ciiva.com/28405/pyu-rc0201-51-rohs-l-8-28405609.pdf?src-supplier=Avnet+Europe; ComponentLink6Description: https://datasheet.ciiva.com/28405/pyu-rc0201-51-rohs-l-8-28405609.pdf?src-supplier=Avnet+Europe; ComponentLink7URL: https://datasheet.ciiva.com/26829/getdatasheetpartid-421074-26829851.pdf?src-supplier=Verical; ComponentLink7Description: https://datasheet.ciiva.com/26829/getdatasheetpartid-421074-26829851.pdf?src-supplier=Verical; ComponentLink8URL: https://datasheet.ciiva.com/46391/1421516-46391339.pdf?src-supplier=Element14; ComponentLink8Description: https://datasheet.ciiva.com/46391/1421516-46391339.pdf?src-supplier=Element14; ComponentLink9URL: https://datasheet.ciiva.com/16855/pyu-rc0201-51-rohs-l-8-16855789.pdf?src-supplier=Avnet+Europe; ComponentLink9Description: https://datasheet.ciiva.com/16855/pyu-rc0201-51-rohs-l-8-16855789.pdf?src-supplier=Avnet+Europe
R31 = Res2: RES SMD 5.49K OHM 1% 1/20W 0201; Manufacturer: Yageo; Manufacturer Part Number: RC0201FR-075K49L; Resistance: 5.49kR; Max Power Dissipation: 50mW; Temperature Coefficient: 200ppm/°C; Value: 5.49k; Supplier 1: Digi-Key; Supplier Part Number 1: YAG2744CT-ND; RoHS: Yes; Category: Chip SMD Resistors; Stock 1: 10000; Pricing 1: 1=0,10000, 10=0,04200, 100=0,01700, 1000=0,00765, 2500=0,00664, 5000=0,00548 (USD); Case/Package: 0201; Case Code (Metric): 0603; Case Code (Imperial): 0201; Min Operating Temperature: -55°C; Max Operating Temperature: 125°C; Packaging: Tape and Reel; Resistor Type: Thick Film; Number of Terminations: 2; Tolerance: 1%; Features: Moisture Resistant; Length: 0.024inch; Width: 0.012inch; Height: 0.01inch; RoHS Compliant: Yes; ComponentLink1URL: http://www.yageo.com/documents/recent/PYu-RC_Group_51_RoHS_L_10.pdf?src-supplier=Digi-Key; ComponentLink1Description: http://www.yageo.com/documents/recent/PYu-RC_Group_51_RoHS_L_10.pdf?src-supplier=Digi-Key; ComponentLink2URL: http://www.yageo.com.tw/exep/pages/download/literatures/PYu-R_INT-thick_7.pdf?src-supplier=Digi-Key; ComponentLink2Description: http://www.yageo.com.tw/exep/pages/download/literatures/PYu-R_INT-thick_7.pdf?src-supplier=Digi-Key
R51 = Res2: Res Thick Film 0201 30.9K Ohm 1% 0.05W(1/20W) ±200ppm/C Molded SMD Paper T/R; Manufacturer: Yageo; Manufacturer Part Number: RC0201FR-0730K9L; Resistance: 30.9kR; Max Power Dissipation: 50mW; Temperature Coefficient: 200ppm/°C; Value: 30.9k; Supplier 1: Digi-Key; Supplier Part Number 1: YAG2591CT-ND; RoHS: Yes; Category: Chip SMD Resistors; Stock 1: 15064; Pricing 1: 1=0,10000, 10=0,04200, 100=0,01700, 1000=0,00765, 2500=0,00664, 5000=0,00548 (USD); Case/Package: 0201; Case Code (Metric): 0603; Case Code (Imperial): 0201; Min Operating Temperature: -55°C; Max Operating Temperature: 125°C; Tolerance: 1%; Packaging: Tape and Reel; Resistor Type: Thick Film; Number of Terminations: 2; Features: Moisture Resistant; Length: 0.024inch; Width: 0.012inch; Height: 0.01inch; Depth: 0.3mm; Military Standard: Not; RoHS Compliant: Yes; ComponentLink1URL: http://components.arrow.com/part/dataview/0323_03295173?src-supplier=Arrow+Europe; ComponentLink1Description: http://components.arrow.com/part/dataview/0323_03295173?src-supplier=Arrow+Europe; ComponentLink2URL: http://www.yageo.com.tw/exep/pages/download/literatures/PYu-R_INT-thick_7.pdf?src-supplier=Digi-Key; ComponentLink2Description: http://www.yageo.com.tw/exep/pages/download/literatures/PYu-R_INT-thick_7.pdf?src-supplier=Digi-Key; ComponentLink3URL: http://www.yageo.com/documents/recent/PYu-RC_Group_51_RoHS_L_9.pdf?src-supplier=Digi-Key; ComponentLink3Description: http://www.yageo.com/documents/recent/PYu-RC_Group_51_RoHS_L_9.pdf?src-supplier=Digi-Key
R63 = Resistor: RES SMD 200 OHM 1% 1/20W 0201; Manufacturer: Yageo; Manufacturer Part Number: RC0201FR-07200RL; Voltage Rating: 25V; Power Rating: 50mW; Temperature Coefficient: 200ppm/°C; Value: 200R; Supplier 1: Digi-Key; Supplier Part Number 1: YAG2495CT-ND; RoHS: Yes; Category: Chip SMD Resistors; Stock 1: 262827; Pricing 1: 1=0,10000, 10=0,04200, 100=0,01700, 1000=0,00765, 2500=0,00664, 5000=0,00548 (USD); Case/Package: 0201; Case Code (Imperial): 0201; Case Code (Metric): 0603; Size Code: 0201; Min Operating Temperature: -55°C; Max Operating Temperature: 125°C; Package Quantity: 10000; Resistance: 200R; Tolerance: 1%; Packaging: Tape and Reel; Resistor Type: Thick Film; Termination: SMD/SMT; Number of Terminations: 2; Max Power Dissipation: 50mW; Features: Moisture Resistant; Series: RC; Construction: Rectangular; Length: 0.6mm; Width: 0.3mm; Height: 0.01inch; Depth: 0.3mm; Military Standard: Not; Lead Free: Lead Free; RoHS Compliant: Yes; ComponentLink1URL: http://components.arrow.com/part/dataview/0323_03297075?src-supplier=Arrow+Europe; ComponentLink1Description: http://components.arrow.com/part/dataview/0323_03297075?src-supplier=Arrow+Europe; ComponentLink2URL: http://www.mouser.com/ds/2/447/RC0201-559633.pdf?src-supplier=Mouser; ComponentLink2Description: http://www.mouser.com/ds/2/447/RC0201-559633.pdf?src-supplier=Mouser; ComponentLink3URL: http://www.yageo.com/documents/recent/PYu-RC_Group_51_RoHS_L_9.pdf?src-supplier=Digi-Key; ComponentLink3Description: http://www.yageo.com/documents/recent/PYu-RC_Group_51_RoHS_L_9.pdf?src-supplier=Digi-Key; ComponentLink4URL: http://www.yageo.com/documents/recent/PYu-RC_Group_51_RoHS_L_10.pdf?src-supplier=Digi-Key; ComponentLink4Description: http://www.yageo.com/documents/recent/PYu-RC_Group_51_RoHS_L_10.pdf?src-supplier=Digi-Key; ComponentLink5URL: http://www.yageo.com/documents/recent/PYu-RC0201_51_RoHS_L_(8).pdf?src-supplier=Future+Electronics; ComponentLink5Description: http://www.yageo.com/documents/recent/PYu-RC0201_51_RoHS_L_(8).pdf?src-supplier=Future+Electronics
R72 R73 = Res2: Res Thick Film 0201 5.1K Ohm 1% 1/20W ±200ppm/°C Molded SMD Paper T/R; Manufacturer: Yageo; Manufacturer Part Number: RC0201FR-075K1L; Power Rating: 50mW; Resistance: 5.1kR; Voltage Rating: 25V; Value: 5.1k; Supplier 1: Digi-Key; Supplier Part Number 1: YAG2741CT-ND; RoHS: Yes; Category: Chip SMD Resistors; Stock 1: 21884; Pricing 1: 1=0,10000, 10=0,04200, 100=0,01700, 1000=0,00765, 2500=0,00664, 5000=0,00548 (USD); Case/Package: 0201; Case Code (Imperial): 0201; Case Code (Metric): 0603; Min Operating Temperature: -55°C; Max Operating Temperature: 125°C; Packaging: Tape and Reel; Tolerance: 1%; Resistor Type: Thick Film; Termination: SMD/SMT; Number of Terminations: 2; Temperature Coefficient: 200ppm/°C; Max Power Dissipation: 50mW; Features: Moisture Resistant; Series: RC; Construction: Rectangular; Length: 0.6mm; Width: 0.3mm; Height: 0.01inch; Depth: 0.3mm; Military Standard: Not; Lead Free: Lead Free; RoHS Compliant: Yes; ComponentLink1URL: http://components.arrow.com/part/dataview/0323_03295052?src-supplier=Arrow+Europe; ComponentLink1Description: http://components.arrow.com/part/dataview/0323_03295052?src-supplier=Arrow+Europe; ComponentLink2URL: http://www.mouser.com/ds/2/447/RC0201-559633.pdf?src-supplier=Mouser; ComponentLink2Description: http://www.mouser.com/ds/2/447/RC0201-559633.pdf?src-supplier=Mouser; ComponentLink3URL: http://www.yageo.com/documents/recent/PYu-RC_Group_51_RoHS_L_10.pdf?src-supplier=Digi-Key; ComponentLink3Description: http://www.yageo.com/documents/recent/PYu-RC_Group_51_RoHS_L_10.pdf?src-supplier=Digi-Key
U1 = BQ25601DRTWR: IC BATTERY CHARGER LION 24WQFN; Manufacturer: Texas Instruments; Number of Cells: 1; Fault Protection: Over Voltage,Over Temperature; Interface: I2C; Max Charge Current: 3A; Battery Pack Voltage: 4.2V; Max Supply Voltage: 13.5V; Supplier 1: Digi-Key; Supplier Part Number 1: 296-46558-1-ND; Manufacturer Part Number: BQ25601RTWT; RoHS: Yes; Category: Power Management ICs; Pricing 1: 1=3,88000, 10=3,48700, 25=3,29600, 100=2,85660 (USD); Min Operating Temperature: -40°C; Max Operating Temperature: 85°C; Packaging: Tape and Reel; RoHS Compliant: Yes; ComponentLink1URL: http://www.ti.com/lit/ds/symlink/bq25601.pdf?src-supplier=Digi-Key; ComponentLink1Description: http://www.ti.com/lit/ds/symlink/bq25601.pdf?src-supplier=Digi-Key; ComponentLink2URL: http://www.ti.com/lit/ds/symlink/bq25601.pdf?src-supplier=Farnell; ComponentLink2Description: http://www.ti.com/lit/ds/symlink/bq25601.pdf?src-supplier=Farnell; ComponentLink3URL: http://www.ti.com/lit/ds/symlink/bq25601.pdf?src-supplier=Newark; ComponentLink3Description: http://www.ti.com/lit/ds/symlink/bq25601.pdf?src-supplier=Newark
U2 = MAX17222ELT+: Conv DC-DC Single Step Up 0.4V to 5.5V 6-Pin uDFN Cut Tape; Manufacturer_Name: Maxim Integrated; Manufacturer: Maxim; Topology: Boost; Output Type: Adjustable; Output Configuration: Positive; Number of Outputs: 1; Min Input Voltage: 400mV; Min Output Voltage: 1.8V; Max Output Voltage: 5V; Output Current: 500mA; Switching Frequency: 2.5MHz; Synchronous Rectifier: Yes; Datasheet Link: https://pdfserv.maximintegrated.com/package_dwgs/21-0164.PDF; Height: 0.8mm; Manufacturer_Part_Number: MAX17222ELT+; Mouser Part Number: 700-MAX17222ELT+; Mouser Price/Stock: https://www.mouser.co.uk/ProductDetail/Maxim-Integrated/MAX17222ELT%2b?qs=5HRuLjoIg%2FFT2yPfIoCzoQ%3D%3D; Supplier 1: Digi-Key; Supplier Part Number 1: MAX17222ELT+-ND; Manufacturer Part Number: MAX17222ELT+; RoHS: Yes; Category: Voltage Regulators - Switching; Number of Pins: 6; Min Operating Temperature: -40°C; Max Operating Temperature: 85°C; Packaging: Rail/Tube; Max Input Voltage: 5.5V; RoHS Compliant: Yes; ComponentLink1URL: http://www.farnell.com/datasheets/2236349.pdf?src-supplier=Farnell; ComponentLink1Description: http://www.farnell.com/datasheets/2236349.pdf?src-supplier=Farnell; ComponentLink2URL: https://datasheets.maximintegrated.com/en/ds/MAX17220-MAX17225.pdf?src-supplier=Digi-Key; ComponentLink2Description: https://datasheets.maximintegrated.com/en/ds/MAX17220-MAX17225.pdf?src-supplier=Digi-Key
U10 = SP0505BAJTG: ESD Suppressors Five CH Space Saving ESD Protect Device; Manufacturer: Texas Instruments; Capacitance: 8.4pF; Operating Supply Voltage: 5.5V; Direction: Unidirectional; Number of Unidirectional Channels: 5; Number of Bidirectional Channels: 4; Reverse Standoff Voltage: 5V; Min Breakdown Voltage: 6V; Clamping Voltage: 15.6V; Peak Pulse Power: 40W; Power Line Protection: No; Peak Pulse Current: 10A; Diode Type: ZENER; Supplier 1: Digi-Key; Supplier Part Number 1: 296-43577-1-ND; Manufacturer Part Number: TPD5E003DPFR; RoHS: Yes; Category: Integrated Circuits (ICs); Stock 1: 1694; Pricing 1: 1=0,65000, 10=0,56000, 100=0,41850, 500=0,32882, 1000=0,25408, 2000=0,24675 (USD); Mount: Surface Mount; Number of Pins: 6; Min Operating Temperature: -40°C; Max Operating Temperature: 125°C; Package Quantity: 5000; Packaging: Tape and Reel; Breakdown Voltage: 6V; Number of Channels: 5; Termination: SMD/SMT; Polarity: Unidirectional; Working Voltage: 5V; Max Power Dissipation: 40W; Resistor Type: Zener; Series: -; Lead Free: Lead Free; RoHS Compliant: Yes; ComponentLink1URL: https://datasheet.ciiva.com/6577/tpd5e003-6577651.pdf?src-supplier=Digi-Key; ComponentLink1Description: https://datasheet.ciiva.com/6577/tpd5e003-6577651.pdf?src-supplier=Digi-Key
U14 = XCL206A333CR-G: Conv DC-DC Single Step Down 2V to 6V 6-Pin CL-2025-02 T/R; Manufacturer_Name: Torex; Number of Outputs: 1; Voltage - Output 1: 3.3V; Max Output Current: 600mA; Efficiency: 90%; Datasheet Link: https://www.torexsemi.com/file/xcl206/XCL205-XCL206-XCL207.pdf; Height: 1.04mm; Manufacturer_Part_Number: XCL206A333CR-G; Mouser Part Number: 865-XCL206A333CR-G; Mouser Price/Stock: https://www.mouser.co.uk/ProductDetail/Torex-Semiconductor/XCL206A333CR-G/?qs=AsjdqWjXhJ9IhOCsNg2OkA%3D%3D; Supplier 1: Digi-Key; Supplier Part Number 1: 893-1403-1-ND; Manufacturer: Torex; Manufacturer Part Number: XCL206A333CR-G; RoHS: Yes; Category: Board Mount Modules; Stock 1: 3329; Pricing 1: 1=2,74000, 10=2,45800, 25=2,31880, 100=1,97560, 250=1,85500, 500=1,62312, 1000=1,34488 (USD); Mount: Surface Mount; Min Operating Temperature: -40°C; Max Operating Temperature: 85°C; Packaging: Cut Tape; Min Input Voltage: 2V; Max Input Voltage: 6V; RoHS Compliant: Yes; ComponentLink1URL: https://www.torexsemi.com/file/xcl206/XCL205-XCL206-XL207.pdf?src-supplier=Digi-Key; ComponentLink1Description: https://www.torexsemi.com/file/xcl206/XCL205-XCL206-XL207.pdf?src-supplier=Digi-Key
U16 = LP5907UVX-1.6_NOPB: IC REG LINEAR 1.8V 250MA 4DSBGA; Manufacturer: Texas Instruments; Manufacturer Part Number: LP5907UVX-1.8/NOPB; Number of Outputs: 1; Min Input Voltage: 2.2V; Max Input Voltage: 5.5V; Polarity: Positive; Quiescent Current: 25uA; Accuracy: 2%; Dropout Voltage: 50mV; Output Type: Fixed; Supplier 1: Digi-Key; Supplier Part Number 1: 296-35634-1-ND; RoHS: Yes; Category: Voltage Regulators - Linear; Pricing 1: 1=0,69000, 10=0,59200, 25=0,55280, 100=0,44220, 250=0,41064, 500=0,34746, 1000=0,26850 (USD); Mount: Surface Mount; Case/Package: SMD/SMT; Min Operating Temperature: -40°C; Max Operating Temperature: 125°C; Package Quantity: 3000; Packaging: Tape and Reel; Max Output Current: 250mA; Output Voltage: 1.8V; Radiation Hardening: No; Lead Free: Lead Free; RoHS Compliant: Yes; ComponentLink1URL: https://datasheet.ciiva.com/6597/lp5907-6597398.pdf?src-supplier=Digi-Key; ComponentLink1Description: https://datasheet.ciiva.com/6597/lp5907-6597398.pdf?src-supplier=Digi-Key; ComponentLink2URL: https://datasheet.ciiva.com/14278/lp5907-14278557.pdf?src-supplier=Avnet; ComponentLink2Description: https://datasheet.ciiva.com/14278/lp5907-14278557.pdf?src-supplier=Avnet
USB = 1054500101: TE CONNECTIVITY         2129691-1             USB, 3.1 TYPE C, 24POS, RCPT, SMT/TH; Manufacturer: TE Connectivity AMP; Plating: Bright; Gender: Receptacle; Number of Ports: 1; USB Standard: USB 3.1; Contact Current Rating: 5A; Circuit Application: Signal; Connector System: Cable-to-Board; Number of Positions: 24; Plating Thickness: 0.75um; Pitch: 0.5mm; Supplier 1: Digi-Key; Supplier Part Number 1: A122008DKR-ND; Manufacturer Part Number: 2129691-1; RoHS: Yes; Category: Connectors; Pricing 1: 1=2,89000, 10=2,77000, 25=2,53880, 50=2,42340, 100=2,30810, 250=2,01956, 500=1,96186 (USD); Mount: Surface Mount; Number of Pins: 24; Contact Material: Copper Alloy; Contact Plating: Gold; Housing Color: Black; Housing Material: Thermoplastic; Min Operating Temperature: -30°C; Max Operating Temperature: 85°C; Orientation: Right Angle; Packaging: Tape and Reel; Termination: Solder; Connector Type: Receptacle; Length: 12.35mm; REACH SVHC: Unknown; Lead Free: Lead Free; RoHS Compliant: Yes; ComponentLink1URL: http://www.farnell.com/datasheets/1993946.pdf?src-supplier=Farnell; ComponentLink1Description: http://www.farnell.com/datasheets/1993946.pdf?src-supplier=Farnell; ComponentLink2URL: https://media.digikey.com/pdf/Data%20Sheets/Tyco%20Electonics%20AMP%20PDFs/2129691_Dwg.pdf?src-supplier=Digi-Key; ComponentLink2Description: https://media.digikey.com/pdf/Data%20Sheets/Tyco%20Electonics%20AMP%20PDFs/2129691_Dwg.pdf?src-supplier=Digi-Key; ComponentLink3URL: http://www.farnell.com/datasheets/2292385.pdf?src-supplier=Farnell; ComponentLink3Description: http://www.farnell.com/datasheets/2292385.pdf?src-supplier=Farnell; ComponentLink4URL: http://www.alliedelec.com/images/products/datasheets/bm/TE_Connectivity/70718395.pdf?src-supplier=Allied+Electronics; ComponentLink4Description: http://www.alliedelec.com/images/products/datasheets/bm/TE_Connectivity/70718395.pdf?src-supplier=Allied+Electronics; ComponentLink5URL: http://www.farnell.com/cad/1993947.pdf?src-supplier=Element14; ComponentLink5Description: http://www.farnell.com/cad/1993947.pdf?src-supplier=Element14; ComponentLink6URL: http://www.farnell.com/datasheets/1993946.pdf?src-supplier=Element14; ComponentLink6Description: http://www.farnell.com/datasheets/1993946.pdf?src-supplier=Element14; ComponentLink7URL: http://www.farnell.com/datasheets/2292385.pdf?src-supplier=Newark; ComponentLink7Description: http://www.farnell.com/datasheets/2292385.pdf?src-supplier=Newark; ComponentLink8URL: http://www.te.com/commerce/DocumentDelivery/DDEController?Action=showdoc&DocId=Customer+Drawing%7F2129691%7F6%7Fpdf%7FEnglish%7FENG_CD_2129691_6.pdf%7F2129691-1&src-supplier=Avnet; ComponentLink8Description: http://www.te.com/commerce/DocumentDelivery/DDEController?Action=showdoc&DocId=Customer+Drawing%7F2129691%7F6%7Fpdf%7FEnglish%7FENG_CD_2129691_6.pdf%7F2129691-1&src-supplier=Avnet